# Altium schematic sheet MCU.SchDoc
size A3; SheetNumber: 2; SheetTotal: 3; SPICEModelCacheRIYNUGNF: <root> / <DocumentId>RIYNUGNF</DocumentId> / </root>
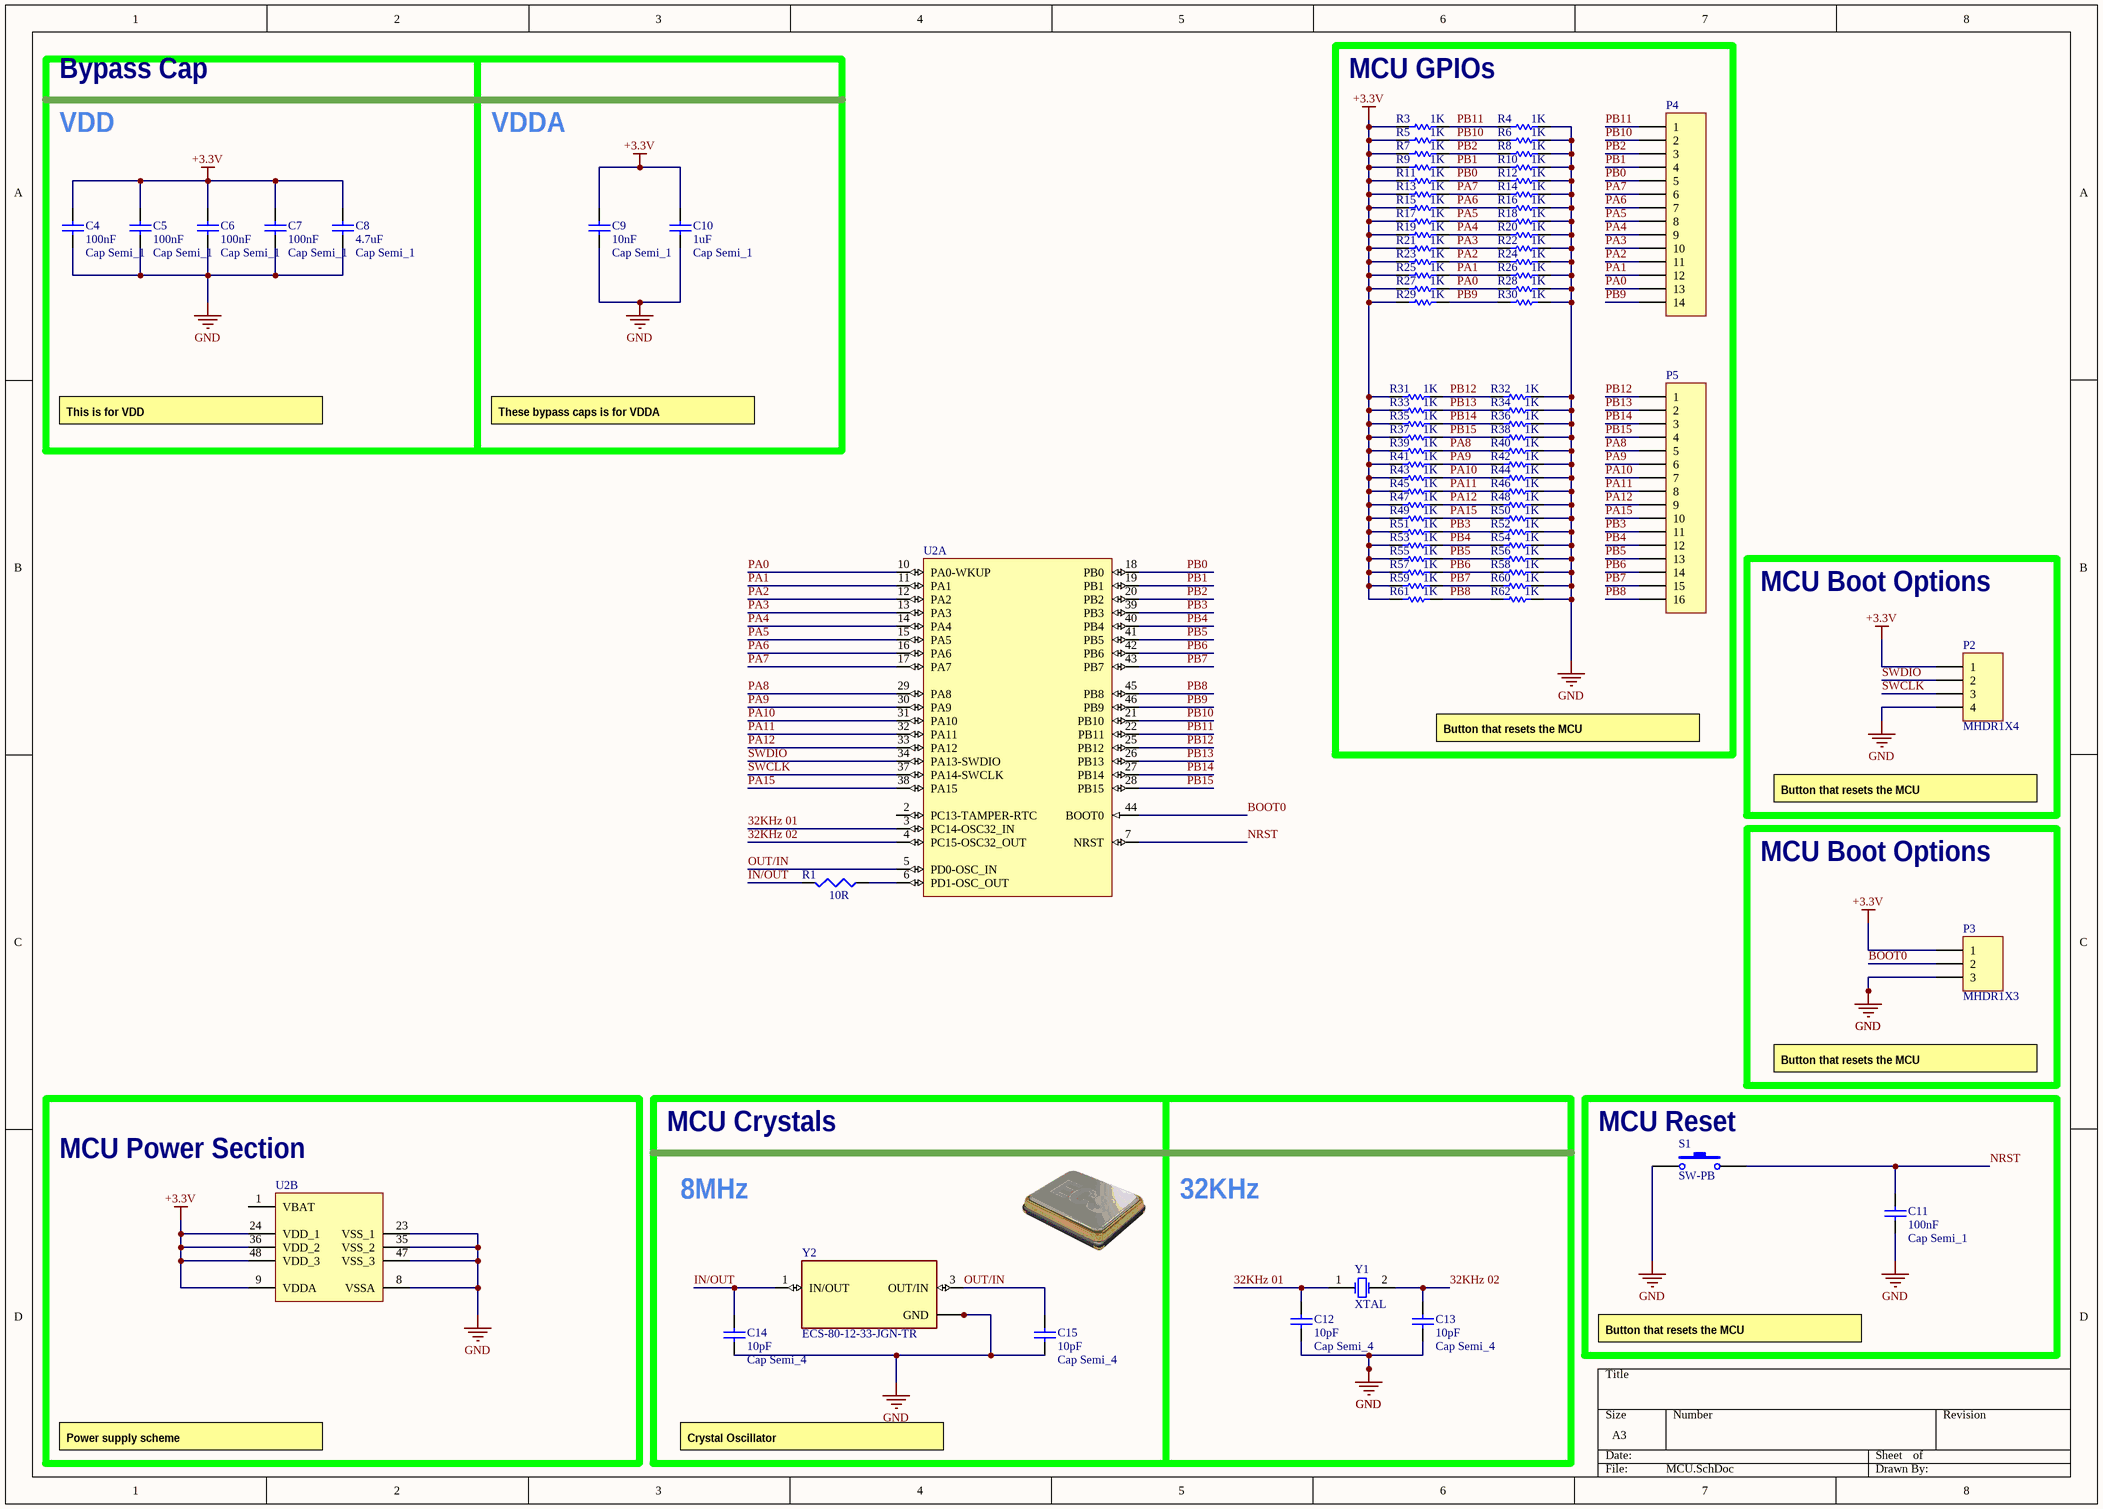
[diagram p0: MCU.SchDoc]

## Parts
C4  Cap Semi_1  value 100nF  [1608[0603]cap]
C5  Cap Semi_1  value 100nF  [1608[0603]cap]
C6  Cap Semi_1  value 100nF  [1608[0603]cap]
C7  Cap Semi_1  value 100nF  [1608[0603]cap]
C8  Cap Semi_1  value 4.7uF  [1608[0603]cap]
C9  Cap Semi_1  value 10nF  [1608[0603]cap]
C10  Cap Semi_1  value 1uF  [1608[0603]cap]
C11  Cap Semi_1  value 100nF  [1608[0603]cap]
C12  Cap Semi_4  value 10pF  [0402cap]
C13  Cap Semi_4  value 10pF  [0402cap]
C14  Cap Semi_4  value 10pF  [0402cap]
C15  Cap Semi_4  value 10pF  [0402cap]
P2  MHDR1X4  [MHDR1X4body]
P3  MHDR1X3  [MHDR1X3body]
P4  (no value)  [MY_FE14]
P5  (no value)  [MY_FE16]
R1  value 10R  [J1-0603]  (hidden comment: Res3)
R3  value 1K  [MY_0603]
R4  value 1K  [MY_0603]
R5  value 1K  [MY_0603]
R6  value 1K  [MY_0603]
R7  value 1K  [MY_0603]
R8  value 1K  [MY_0603]
R9  value 1K  [MY_0603]
R10  value 1K  [MY_0603]
R11  value 1K  [MY_0603]
R12  value 1K  [MY_0603]
R13  value 1K  [MY_0603]
R14  value 1K  [MY_0603]
R15  value 1K  [MY_0603]
R16  value 1K  [MY_0603]
R17  value 1K  [MY_0603]
R18  value 1K  [MY_0603]
R19  value 1K  [MY_0603]
R20  value 1K  [MY_0603]
R21  value 1K  [MY_0603]
R22  value 1K  [MY_0603]
R23  value 1K  [MY_0603]
R24  value 1K  [MY_0603]
R25  value 1K  [MY_0603]
R26  value 1K  [MY_0603]
R27  value 1K  [MY_0603]
R28  value 1K  [MY_0603]
R29  value 1K  [MY_0603]
R30  value 1K  [MY_0603]
R31  value 1K  [MY_0603]
R32  value 1K  [MY_0603]
R33  value 1K  [MY_0603]
R34  value 1K  [MY_0603]
R35  value 1K  [MY_0603]
R36  value 1K  [MY_0603]
R37  value 1K  [MY_0603]
R38  value 1K  [MY_0603]
R39  value 1K  [MY_0603]
R40  value 1K  [MY_0603]
R41  value 1K  [MY_0603]
R42  value 1K  [MY_0603]
R43  value 1K  [MY_0603]
R44  value 1K  [MY_0603]
R45  value 1K  [MY_0603]
R46  value 1K  [MY_0603]
R47  value 1K  [MY_0603]
R48  value 1K  [MY_0603]
R49  value 1K  [MY_0603]
R50  value 1K  [MY_0603]
R51  value 1K  [MY_0603]
R52  value 1K  [MY_0603]
R53  value 1K  [MY_0603]
R54  value 1K  [MY_0603]
R55  value 1K  [MY_0603]
R56  value 1K  [MY_0603]
R57  value 1K  [MY_0603]
R58  value 1K  [MY_0603]
R59  value 1K  [MY_0603]
R60  value 1K  [MY_0603]
R61  value 1K  [MY_0603]
R62  value 1K  [MY_0603]
S1  SW-PB  [SPST-2_body]
U2  (no value)  [STM-LQFP48_N]  (parts A,B of 2)
Y1  XTAL  [32768]
Y2  ECS-80-12-33-JGN-TR  [8MHZCrystall]

## Blocks framed on the sheet
MCU GPIOs: P4 P5 R3-R62
MCU Boot Options: P2
MCU Boot Options: P3
MCU Power Section: U2
MCU Reset: C11 S1

## Nets
+3.3V: C4.1 C5.1 C6.1 C7.1 C8.1 C9.1 C10.1 P2.1 P3.1 R3.2 R5.2 R7.2 R9.2 R11.2 R13.2 R15.2 R17.2 R19.2 R21.2 R23.2 R25.2 R27.2 R29.2 R31.2 R33.2 R35.2 R37.2 R39.2 R41.2 R43.2 R45.2 R47.2 R49.2 R51.2 R53.2 R55.2 R57.2 R59.2 R61.2 U2.9(VDDA) U2.24(VDD_1) U2.36(VDD_2) U2.48(VDD_3)
GND: C4.2 C5.2 C6.2 C7.2 C8.2 C9.2 C10.2 C11.2 C12.1 C13.1 C14.1 C15.1 P2.4 P3.3 R4.1 R6.1 R8.1 R10.1 R12.1 R14.1 R16.1 R18.1 R20.1 R22.1 R24.1 R26.1 R28.1 R30.1 R32.1 R34.1 R36.1 R38.1 R40.1 R42.1 R44.1 R46.1 R48.1 R50.1 R52.1 R54.1 R56.1 R58.1 R60.1 R62.1 S1.1 U2.8(VSSA) U2.23(VSS_1) U2.35(VSS_2) U2.47(VSS_3) Y2.2(GND) Y2.4(GND)
32KHz 01: C12.2 U2.3(PC14-OSC32_IN) Y1.1(OSC1)
32KHz 02: C13.2 U2.4(PC15-OSC32_OUT) Y1.2(OSC2)
BOOT0: P3.2 U2.44(BOOT0)
IN/OUT: C14.2 R1.2 Y2.1(IN/OUT)
NRST: C11.1 S1.2 U2.7(NRST)
OUT/IN: C15.2 U2.5(PD0-OSC_IN) Y2.3(OUT/IN)
PA0: P4.13 R27.1 R28.2 U2.10(PA0-WKUP)
PA1: P4.12 R25.1 R26.2 U2.11(PA1)
PA2: P4.11 R23.1 R24.2 U2.12(PA2)
PA3: P4.10 R21.1 R22.2 U2.13(PA3)
PA4: P4.9 R19.1 R20.2 U2.14(PA4)
PA5: P4.8 R17.1 R18.2 U2.15(PA5)
PA6: P4.7 R15.1 R16.2 U2.16(PA6)
PA7: P4.6 R13.1 R14.2 U2.17(PA7)
PA8: P5.5 R39.1 R40.2 U2.29(PA8)
PA9: P5.6 R41.1 R42.2 U2.30(PA9)
PA10: P5.7 R43.1 R44.2 U2.31(PA10)
PA11: P5.8 R45.1 R46.2 U2.32(PA11)
PA12: P5.9 R47.1 R48.2 U2.33(PA12)
PA15: P5.10 R49.1 R50.2 U2.38(PA15)
PB0: P4.5 R11.1 R12.2 U2.18(PB0)
PB1: P4.4 R9.1 R10.2 U2.19(PB1)
PB2: P4.3 R7.1 R8.2 U2.20(PB2)
PB3: P5.11 R51.1 R52.2 U2.39(PB3)
PB4: P5.12 R53.1 R54.2 U2.40(PB4)
PB5: P5.13 R55.1 R56.2 U2.41(PB5)
PB6: P5.14 R57.1 R58.2 U2.42(PB6)
PB7: P5.15 R59.1 R60.2 U2.43(PB7)
PB8: P5.16 R61.1 R62.2 U2.45(PB8)
PB9: P4.14 R29.1 R30.2 U2.46(PB9)
PB10: P4.2 R5.1 R6.2 U2.21(PB10)
PB11: P4.1 R3.1 R4.2 U2.22(PB11)
PB12: P5.1 R31.1 R32.2 U2.25(PB12)
PB13: P5.2 R33.1 R34.2 U2.26(PB13)
PB14: P5.3 R35.1 R36.2 U2.27(PB14)
PB15: P5.4 R37.1 R38.2 U2.28(PB15)
SWCLK: P2.3 U2.37(PA14-SWCLK)
SWDIO: P2.2 U2.34(PA13-SWDIO)
NetR1_1: R1.1 U2.6(PD1-OSC_OUT)

Not connected (* = marked no-connect by the designer): U2 1(VBAT) 2(PC13-TAMPER-RTC)

## Notes on the sheet
- Bypass Cap
- VDD
- VDDA
- This is for VDD
- These bypass caps is for VDDA
- Button that resets the MCU
- MCU Crystals
- 8MHz
- 32KHz
- Power supply scheme
- Crystal Oscillator

## Library data of the parts
C4-C7 C11 = Cap Semi_1: Capacitor (Semiconductor SIM Model); Published: 8-Jun-2000; LatestRevisionDate: 29-May-2009; LatestRevisionNote: IPC-7351 Footprint Added.; PackageReference: C1206; Publisher: Altium Limited; PackageDescription: Chip Capacitor
C8 = Cap Semi_1_1: Capacitor (Semiconductor SIM Model); Published: 8-Jun-2000; LatestRevisionDate: 29-May-2009; LatestRevisionNote: IPC-7351 Footprint Added.; PackageReference: C1206; Publisher: Altium Limited; PackageDescription: Chip Capacitor
C9 = Cap Semi_1_2: Capacitor (Semiconductor SIM Model); Published: 8-Jun-2000; LatestRevisionDate: 29-May-2009; LatestRevisionNote: IPC-7351 Footprint Added.; PackageReference: C1206; Publisher: Altium Limited; PackageDescription: Chip Capacitor
C10 = Cap Semi_1_3: Capacitor (Semiconductor SIM Model); Published: 8-Jun-2000; LatestRevisionDate: 29-May-2009; LatestRevisionNote: IPC-7351 Footprint Added.; PackageReference: C1206; Publisher: Altium Limited; PackageDescription: Chip Capacitor
C12-C15 = Cap Semi_4: Capacitor (Semiconductor SIM Model); Published: 8-Jun-2000; LatestRevisionDate: 29-May-2009; LatestRevisionNote: IPC-7351 Footprint Added.; PackageReference: C1206; Publisher: Altium Limited; PackageDescription: Chip Capacitor
P2 = MHDR1X4: Header, 4-Pin; LatestRevisionDate: 17-Jul-2002; LatestRevisionNote: Re-released for DXP Platform.; Publisher: Altium Limited
P3 = MHDR1X3: Header, 3-Pin; LatestRevisionDate: 17-Jul-2002; LatestRevisionNote: Re-released for DXP Platform.; Publisher: Altium Limited
P4 = Header 14: Header, 14-Pin; ASiD Part Number: Header 14-AS
P5 = Header 16: Header, 16-Pin; ASiD Part Number: Header 16-AS
R1 = Res3: Resistor; Published: 8-Jun-2000; LatestRevisionDate: 29-May-2009; LatestRevisionNote: IPC-7351 Footprint Added.; PackageReference: J1-0603; Publisher: Altium Limited; PackageDescription: Chip Resistor
R3-R62 = Res: Standard resistor; ASiD Part Number: Res-AS
S1 = SW-PB: Switch; Published: 24-Mar-1999; LatestRevisionDate: 17-Jul-2002; LatestRevisionNote: Re-released for DXP Platform.; PackageReference: SPST-2; Publisher: Altium Limited; PackageDescription: Switch; 2 Leads
U2 = STM32F103C8T6: ARM Cortex-M3 32-bit MCU, 64 KB Flash, 20 KB Internal RAM, 37 I/Os, 48-pin LQFP, -40 to 85 degC, Tray; A/D Converter: 2x12-bit (10 Channel); FLASH Size (Prog) (kB): 64; I/Os (High Current): 37; Internal RAM Size (kB): 20; Operating Frequency(F) (Processor speed) (MHz): 72; Supply Voltage(Vcc) min (V): 2; DatasheetVersion: Rev. 16; PackageVersion: Rev. 6, 06/2013; PackageReference: LQFP48; PackageDescription: 48-Pin Low Profile Quad Flat Package, 7 x 7 mm Body, 0.5 mm Pitch; Supplier 1: Digi-Key; Supplier Part Number 1: 497-6063-ND; Supplier 2: Farnell; Supplier Part Number 2: 1447637; Supplier 3: Newark; Supplier Part Number 3: 59M2182; Supplier 4: Newark; Supplier Part Number 4: 57P1222; Supplier 5: Mouser; Supplier Part Number 5: 511-STM32F103C8T6; Core: ARM Cortex-M3; Packing: Tray; Mounting Technology: Surface Mount; PartNumber: STM32F103C8T6; ComponentLink1Description: Manufacturer URL; ComponentLink1URL: http://www.st.com/web/en/home.html; ComponentLink2Description: Datasheet; ComponentLink2URL: http://www.st.com/st-web-ui/static/active/en/resource/technical/document/datasheet/CD00161566.pdf; ComponentLink3Description: Package Specification; ComponentLink3URL: http://www.st.com/st-web-ui/static/active/en/resource/technical/document/datasheet/DM00058181.pdf
Y1 = XTAL: Crystal Oscillator; Published: 8-Jun-2000; LatestRevisionDate: 17-Jul-2002; LatestRevisionNote: Re-released for DXP Platform.; PackageReference: R38; Publisher: Altium Limited; PackageDescription: Crystal, Thru-Hole; 2 Leads; Body 3.1 x 8.2 mm (Dia.xH)
Y2 = ECS-80-12-33-JGN-TR: 8MHz Â±20ppm Crystal 12pF 400 Ohms 4-SMD, No Lead; MF: ECS Inc.; Package: SMD-4 ECS International; Price: None; Value: *; MP: ECS-80-12-33-JGN-TR; Availability: Warning; SnapEDA_Link: https://www.snapeda.com/parts/ECS-80-12-33-JGN-TR/ECS%20Inc./view-part/4477300/?ref=snap; Mouser-Purchase-URL: https://snapeda.com/shop?store=Mouser&id=4477300; BuyPart: https://www.snapeda.com/parts/ECS-80-12-33-JGN-TR/ECS%20Inc./view-part/4477300/?ref=eda